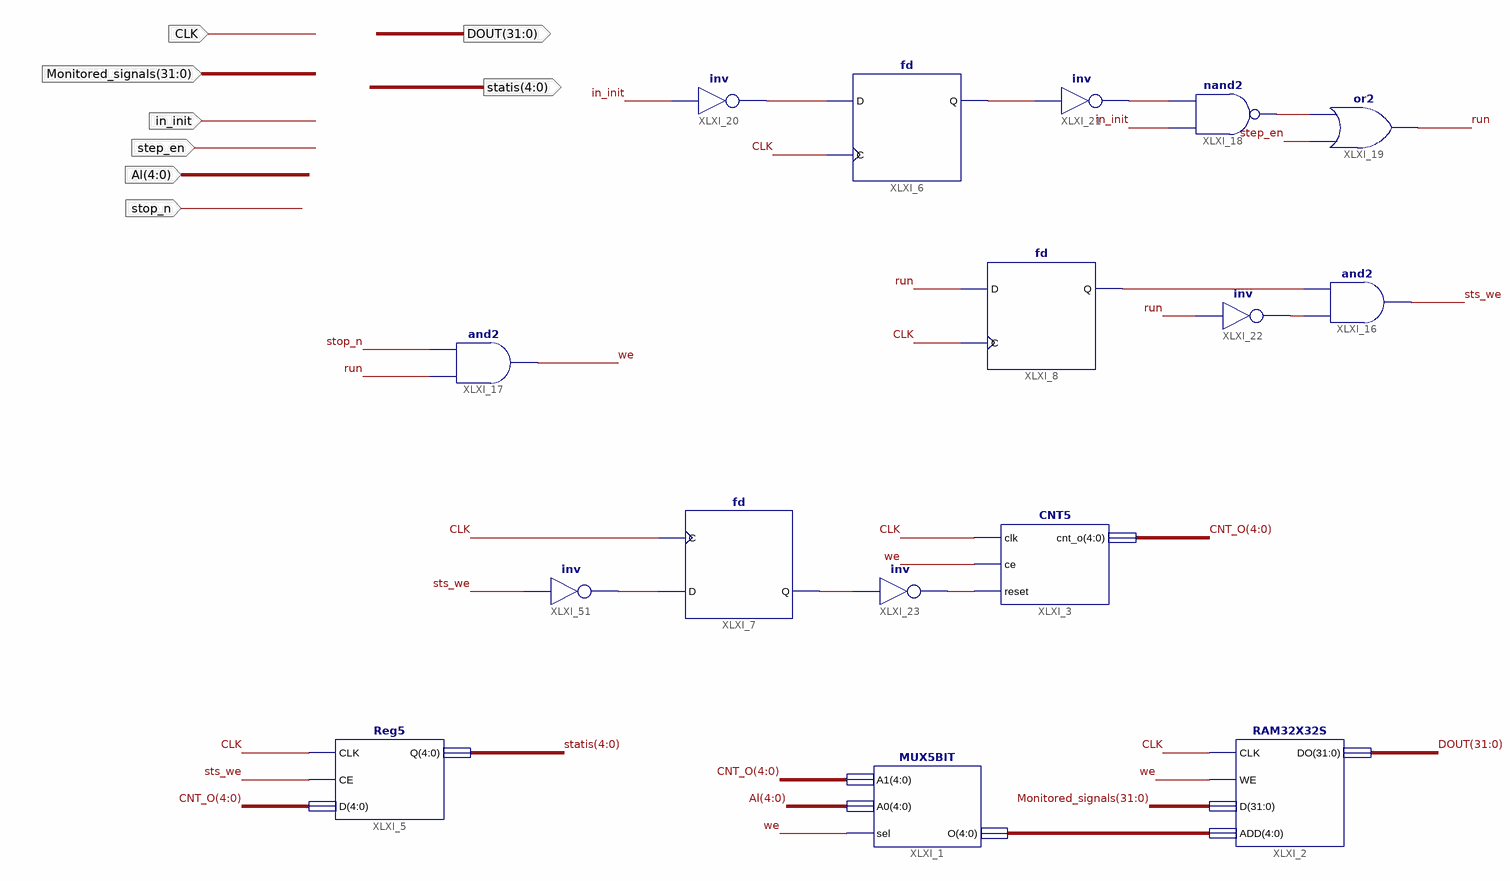
[diagram p0: schematic sheet 1]
// Xilinx ISE schematic logical_analyzer.sch (spartan6) as structural Verilog: 16 symbols, 8 ports
module logical_analyzer (
  input  CLK,
  input  in_init,
  input  step_en,
  input  [31:0] Monitored_signals,
  input  [4:0] Al,
  input  stop_n,
  output [31:0] DOUT,
  output [4:0] statis
);

  wire run, sts_we, we, XLXN_26, XLXN_27, XLXN_28, XLXN_29, XLXN_38, XLXN_41, XLXN_60, XLXN_61, XLXN_62;
  wire [4:0] CNT_O, XLXN_66;

  CNT5 XLXI_3 (.clk(CLK), .ce(we), .reset(XLXN_62), .cnt_o(CNT_O));
  fd XLXI_7 (.C(CLK), .D(XLXN_60), .Q(XLXN_61));
  not XLXI_23 (XLXN_62, XLXN_61);
  and XLXI_17 (we, run, stop_n);
  fd XLXI_6 (.C(CLK), .D(XLXN_26), .Q(XLXN_27));
  not XLXI_20 (XLXN_26, in_init);
  not XLXI_21 (XLXN_28, XLXN_27);
  nand XLXI_18 (XLXN_29, in_init, XLXN_28);
  or XLXI_19 (run, step_en, XLXN_29);
  not XLXI_51 (XLXN_60, sts_we);
  RAM32X32S XLXI_2 (.ADD(XLXN_66), .CLK(CLK), .D(Monitored_signals), .DO(DOUT), .WE(we));
  MUX5BIT XLXI_1 (.sel(we), .A0(Al), .A1(CNT_O), .O(XLXN_66));
  Reg5 XLXI_5 (.CLK(CLK), .CE(sts_we), .D(CNT_O), .Q(statis));
  fd XLXI_8 (.C(CLK), .D(run), .Q(XLXN_41));
  and XLXI_16 (sts_we, XLXN_38, XLXN_41);
  not XLXI_22 (XLXN_38, run);
endmodule
